# EAGLE design rs232-TTL (EAGLE 9.5.2)
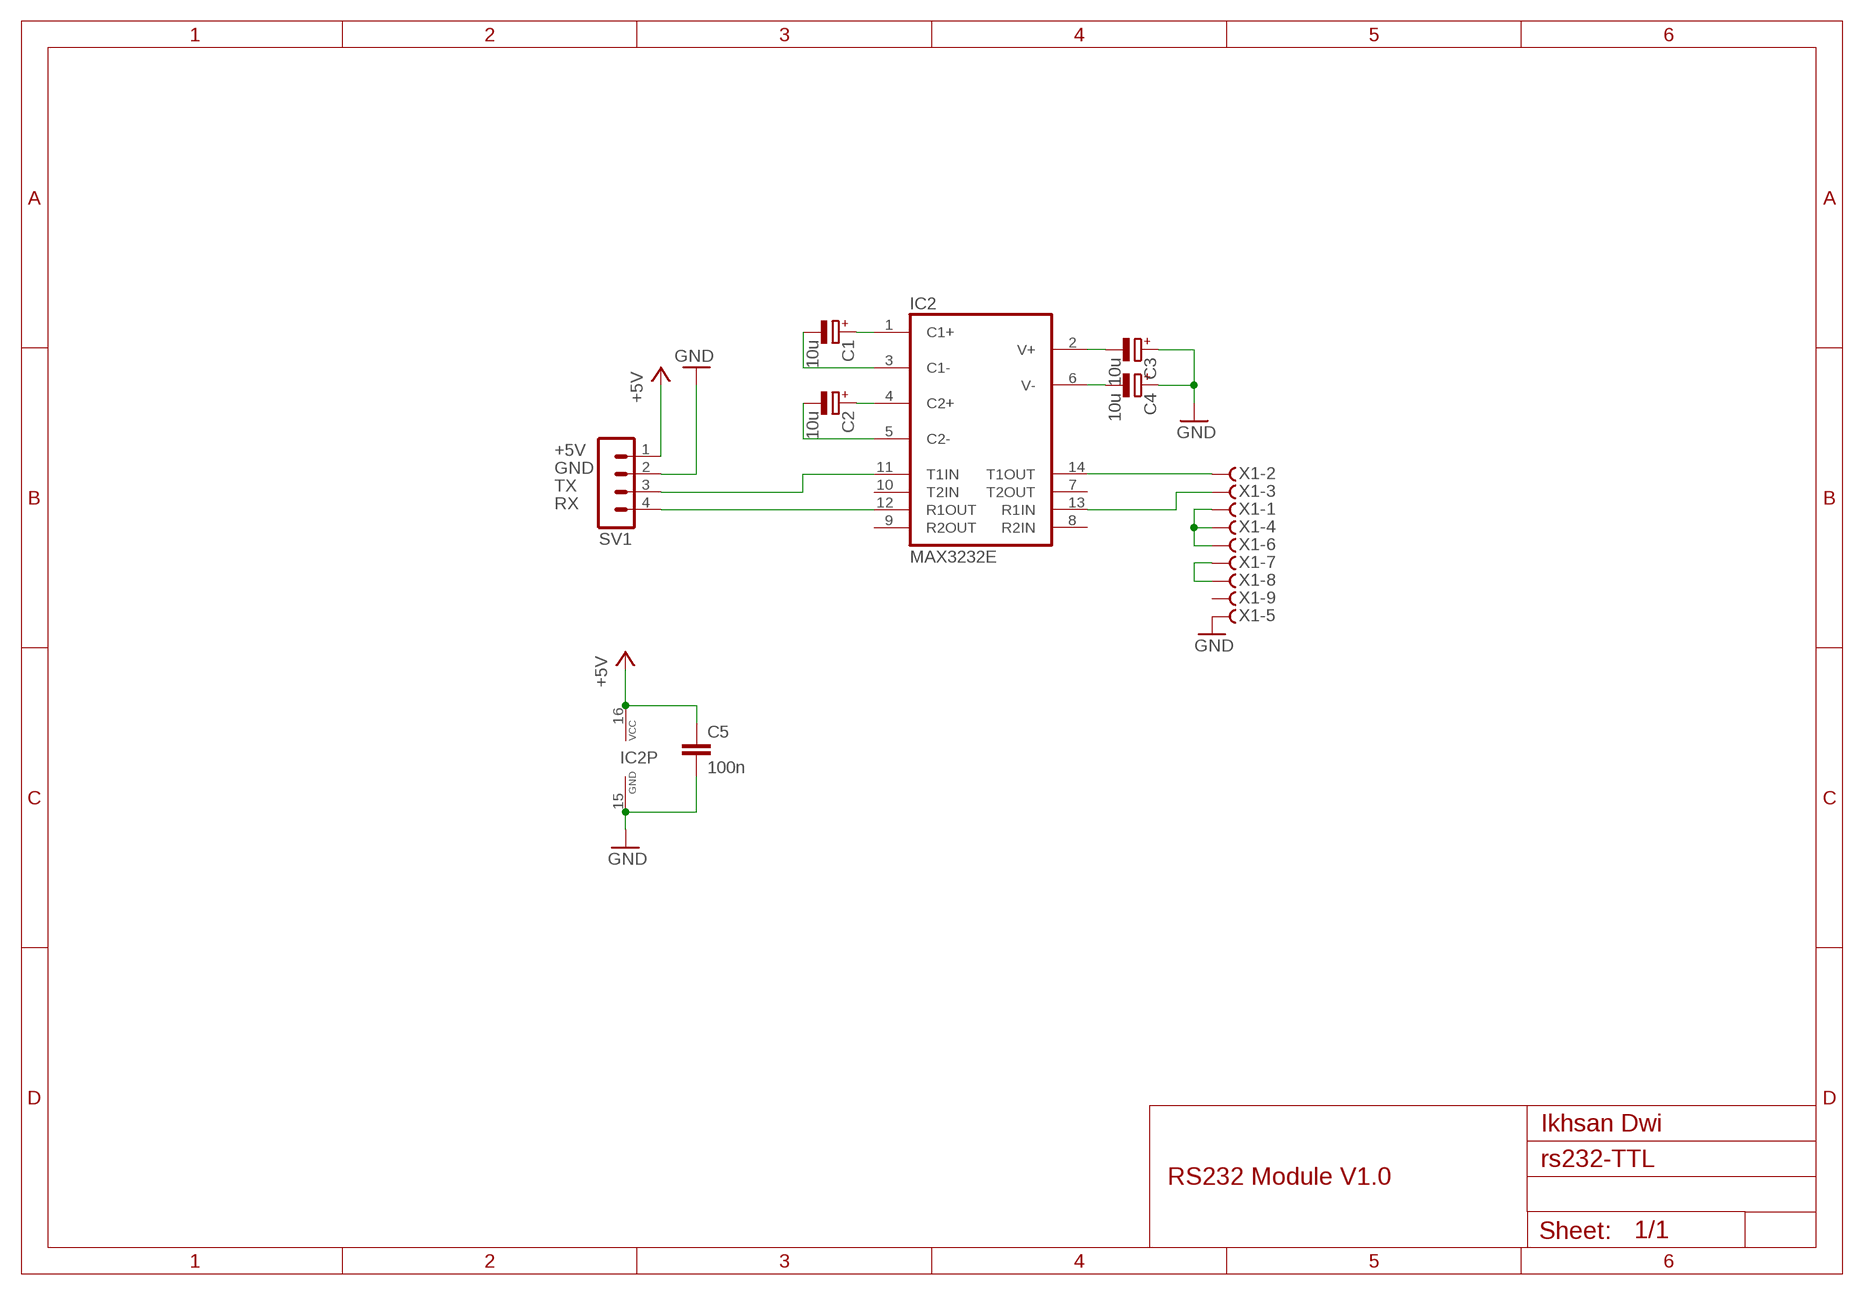
[diagram p0: schematic, sheet 1]

## Parts
C1  10u  CPOL-EUE2.5-6  [E2,5-6]
C2  10u  CPOL-EUE2.5-6  [E2,5-6]
C3  10u  CPOL-EUE2.5-6  [E2,5-6]
C4  10u  CPOL-EUE2.5-6  [E2,5-6]
C5  100n  C-EU050-024X044  [C050-024X044]
IC2  MAX3232E  MAX232  [DIL16]
SV1  MA04-1  [MA04-1]
X1  F09HS  [F09H]

## Nets
+5V: C5.1 IC2.16(VCC) SV1.1
GND: C3.+ C4.+ C5.2 IC2.15(GND) SV1.2 X1.5
N$1: C1.- IC2.3(C1-)
N$2: C1.+ IC2.1(C1+)
N$9: X1.1 X1.4 X1.6
N$10: C2.+ IC2.4(C2+)
N$12: C2.- IC2.5(C2-)
N$13: C3.- IC2.2(V+)
N$14: C4.- IC2.6(V-)
N$16: X1.7 X1.8
N$19: IC2.14(T1OUT) X1.2
N$20: IC2.13(R1IN) X1.3
RX: IC2.12(R1OUT) SV1.4
TX: IC2.11(T1IN) SV1.3
Unconnected: IC2.7(T2OUT) IC2.8(R2IN) IC2.9(R2OUT) IC2.10(T2IN) X1.9

## Notes on the sheet
- Ikhsan Dwi
- RS232 Module V1.0

## Library data of the parts
C1-C4 = rcl:CPOL-EU: POLARIZED CAPACITOR, European symbol
C5 = rcl:C-EU: CAPACITOR, European symbol
IC2 = maxim:MAX232: RS232 TRANSEIVER
SV1 = con-lstb:MA04-1: PIN HEADER
X1 = con-subd:F09HS: HARTING SUB-D

## Board
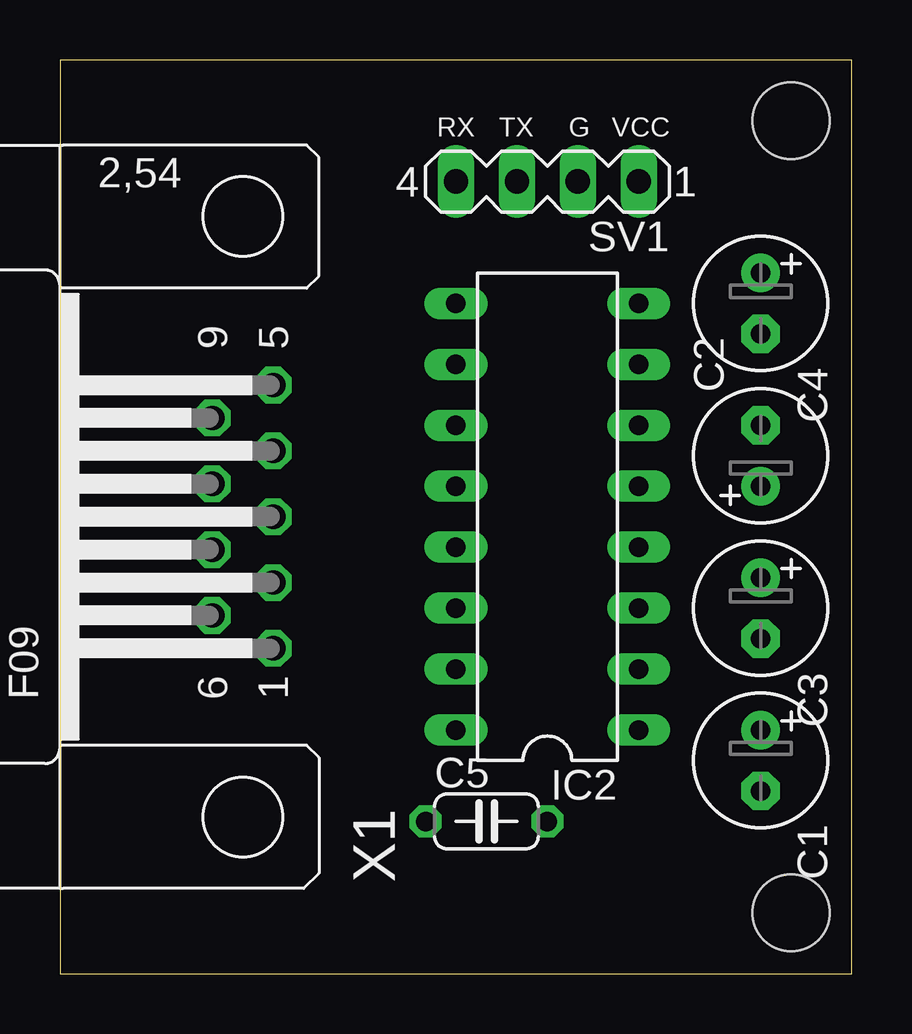
[diagram p1: board, top side]
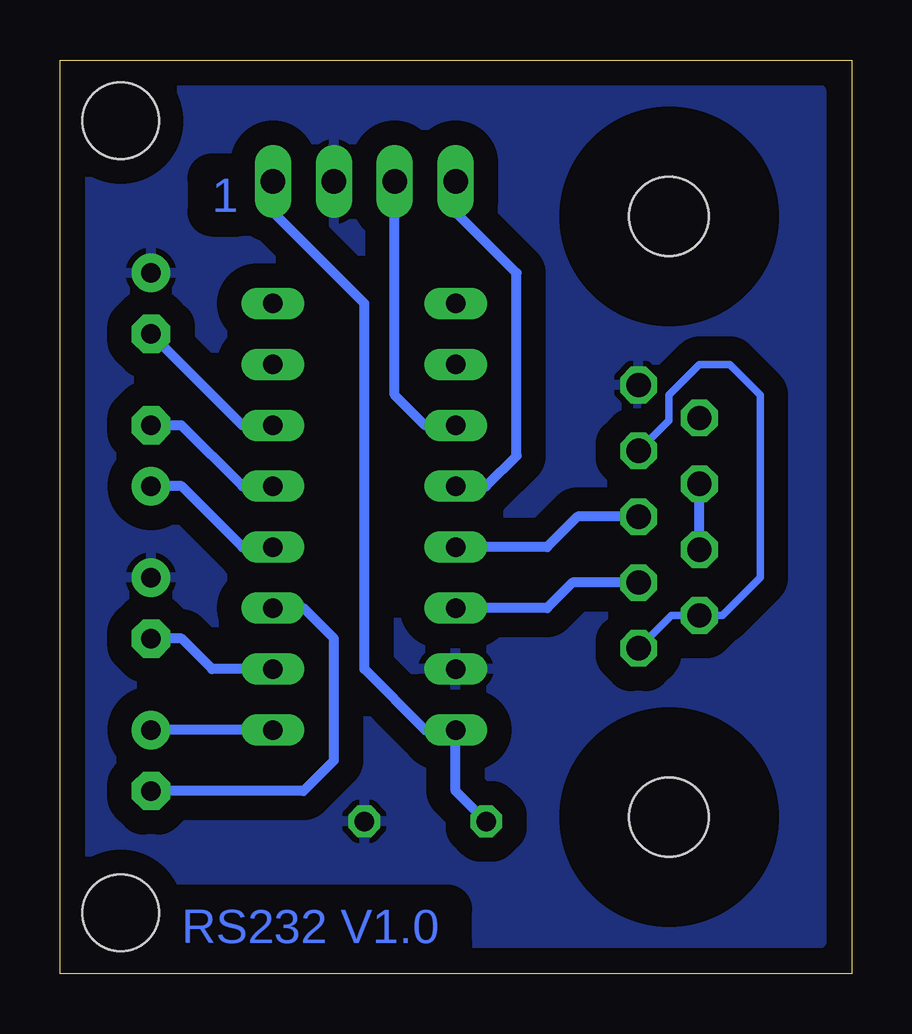
[diagram p2: board, bottom side, seen from below]

Size 33.01 x 38.09 mm. Coordinates in mm from the lower left corner, seen from the top.
Outline: 0,0 33.01,0 33.01,38.09 0,38.09 0,0
Copper layers (1*16): Top 0.035mm / dielectric 1.5mm / Bottom 0.035mm
Design rules "default": minimum track width 10mil, minimum drill 24mil, track to track 8mil, track to pad 8mil, pad to pad 8mil, via to via 8mil, smd to smd 8mil, copper to edge 40mil, drill to drill 8mil, minimum pad ring 10mil, minimum via ring 8mil, stop-mask expansion 4mil, vias tented up to drill 0mil, thermal gap 10mil
Holes 3.2 mm at 30.48,2.54 30.48,35.56

### Footprints (pad centres in the part's own frame; a part is rotated, then mirrored left to right if it is on the bottom)
E2,5-6 = drill 0.813 pad 1.6: + -1.27,0 | drill 0.813 pad 1.6 octagon: - 1.27,0
C050-024X044 = drill 0.813 octagon: 1 -2.54,0; 2 2.54,0
DIL16 = drill 0.813 long: 1 -8.89,-3.81; 2 -6.35,-3.81; 3 -3.81,-3.81; 4 -1.27,-3.81; 5 1.27,-3.81; 6 3.81,-3.81; 7 6.35,-3.81; 8 8.89,-3.81; 9 8.89,3.81; 10 6.35,3.81; 11 3.81,3.81; 12 1.27,3.81; 13 -1.27,3.81; 14 -3.81,3.81; 15 -6.35,3.81; 16 -8.89,3.81
MA04-1 = drill 1.016 long: 1 -3.81,0; 2 -1.27,0; 3 1.27,0; 4 3.81,0
F09H = drill 1.016 octagon: 1 -5.486,-1.27; 2 -2.743,-1.27; 3 0,-1.27; 4 2.743,-1.27; 5 5.486,-1.27; 6 -4.115,1.27; 7 -1.372,1.27; 8 1.372,1.27; 9 4.115,1.27 | hole 3.302: -12.522,0; 12.522,0

### Placement (x,y rotation side)
C1  29.21,8.89 270 top
C2  29.21,21.59 90 top
C3  29.21,15.24 270 top
C4  29.21,27.94 270 top
C5  17.78,6.35 0 top
IC2  20.32,19.05 90 top
SV1  20.32,33.02 180 top
X1  7.62,19.05 90 top

### Tracks (layer width: path | path; a pad name or v marks a point on that pad's centre or on a via)
+5V
  Bottom 0.406: C5.1 16.51,7.62 IC2.16 17.78,10.16 20.32,12.7 20.32,27.94 24.13,31.75 SV1.1
GND
  pour Bottom (isolate 1.016): 1.27,36.83 1.27,1.27 31.75,1.27 31.75,36.83
N$1
  Bottom 0.406: IC2.3 22.86,15.24 21.59,13.97 21.59,8.89 22.86,7.62 C1.-
N$2
  Bottom 0.406: IC2.1 C1.+
N$9
  Bottom 0.305: X1.1 7.52,14.94 X1.6 5.38,14.94 3.81,16.51 3.81,24.13 5.08,25.4 6.35,25.4 7.62,24.13 7.62,23.06 X1.4
N$10
  Bottom 0.406: IC2.4 25.4,17.78 27.94,20.32 C2.+
N$12
  Bottom 0.406: IC2.5 25.4,20.32 27.94,22.86 C2.-
N$13
  Bottom 0.406: IC2.2 26.67,12.7 27.94,13.97 C3.-
N$14
  Bottom 0.406: IC2.6 25.4,22.86 C4.-
N$16
  Bottom 0.406: X1.7 X1.8
N$19
  Bottom 0.406: IC2.14 12.7,15.24 11.63,16.31 X1.2
N$20
  Bottom 0.406: IC2.13 12.7,17.78 11.43,19.05 X1.3
RX
  Bottom 0.406: IC2.12 15.24,20.32 13.97,21.59 13.97,29.21 16.51,31.75 SV1.4
TX
  Bottom 0.406: IC2.11 17.78,22.86 19.05,24.13 SV1.3

### Text on the board
Bottom: 1 | RS232 V1.0
tPlace: RX | TX | G | VCC